# EasyEDA Pro project 辅助电源.eprj

# Schematic Schematic1
Board Name: Board1; Create Date: 2025-11-02; Page Name: P1; Project Name: 辅助电源; Schematic Name: Schematic1; Update Date: 2025-11-02; Company: 广东石油化工电子信息工程学院; Drawed: LMH; Page Size: A4; Version: V1.0
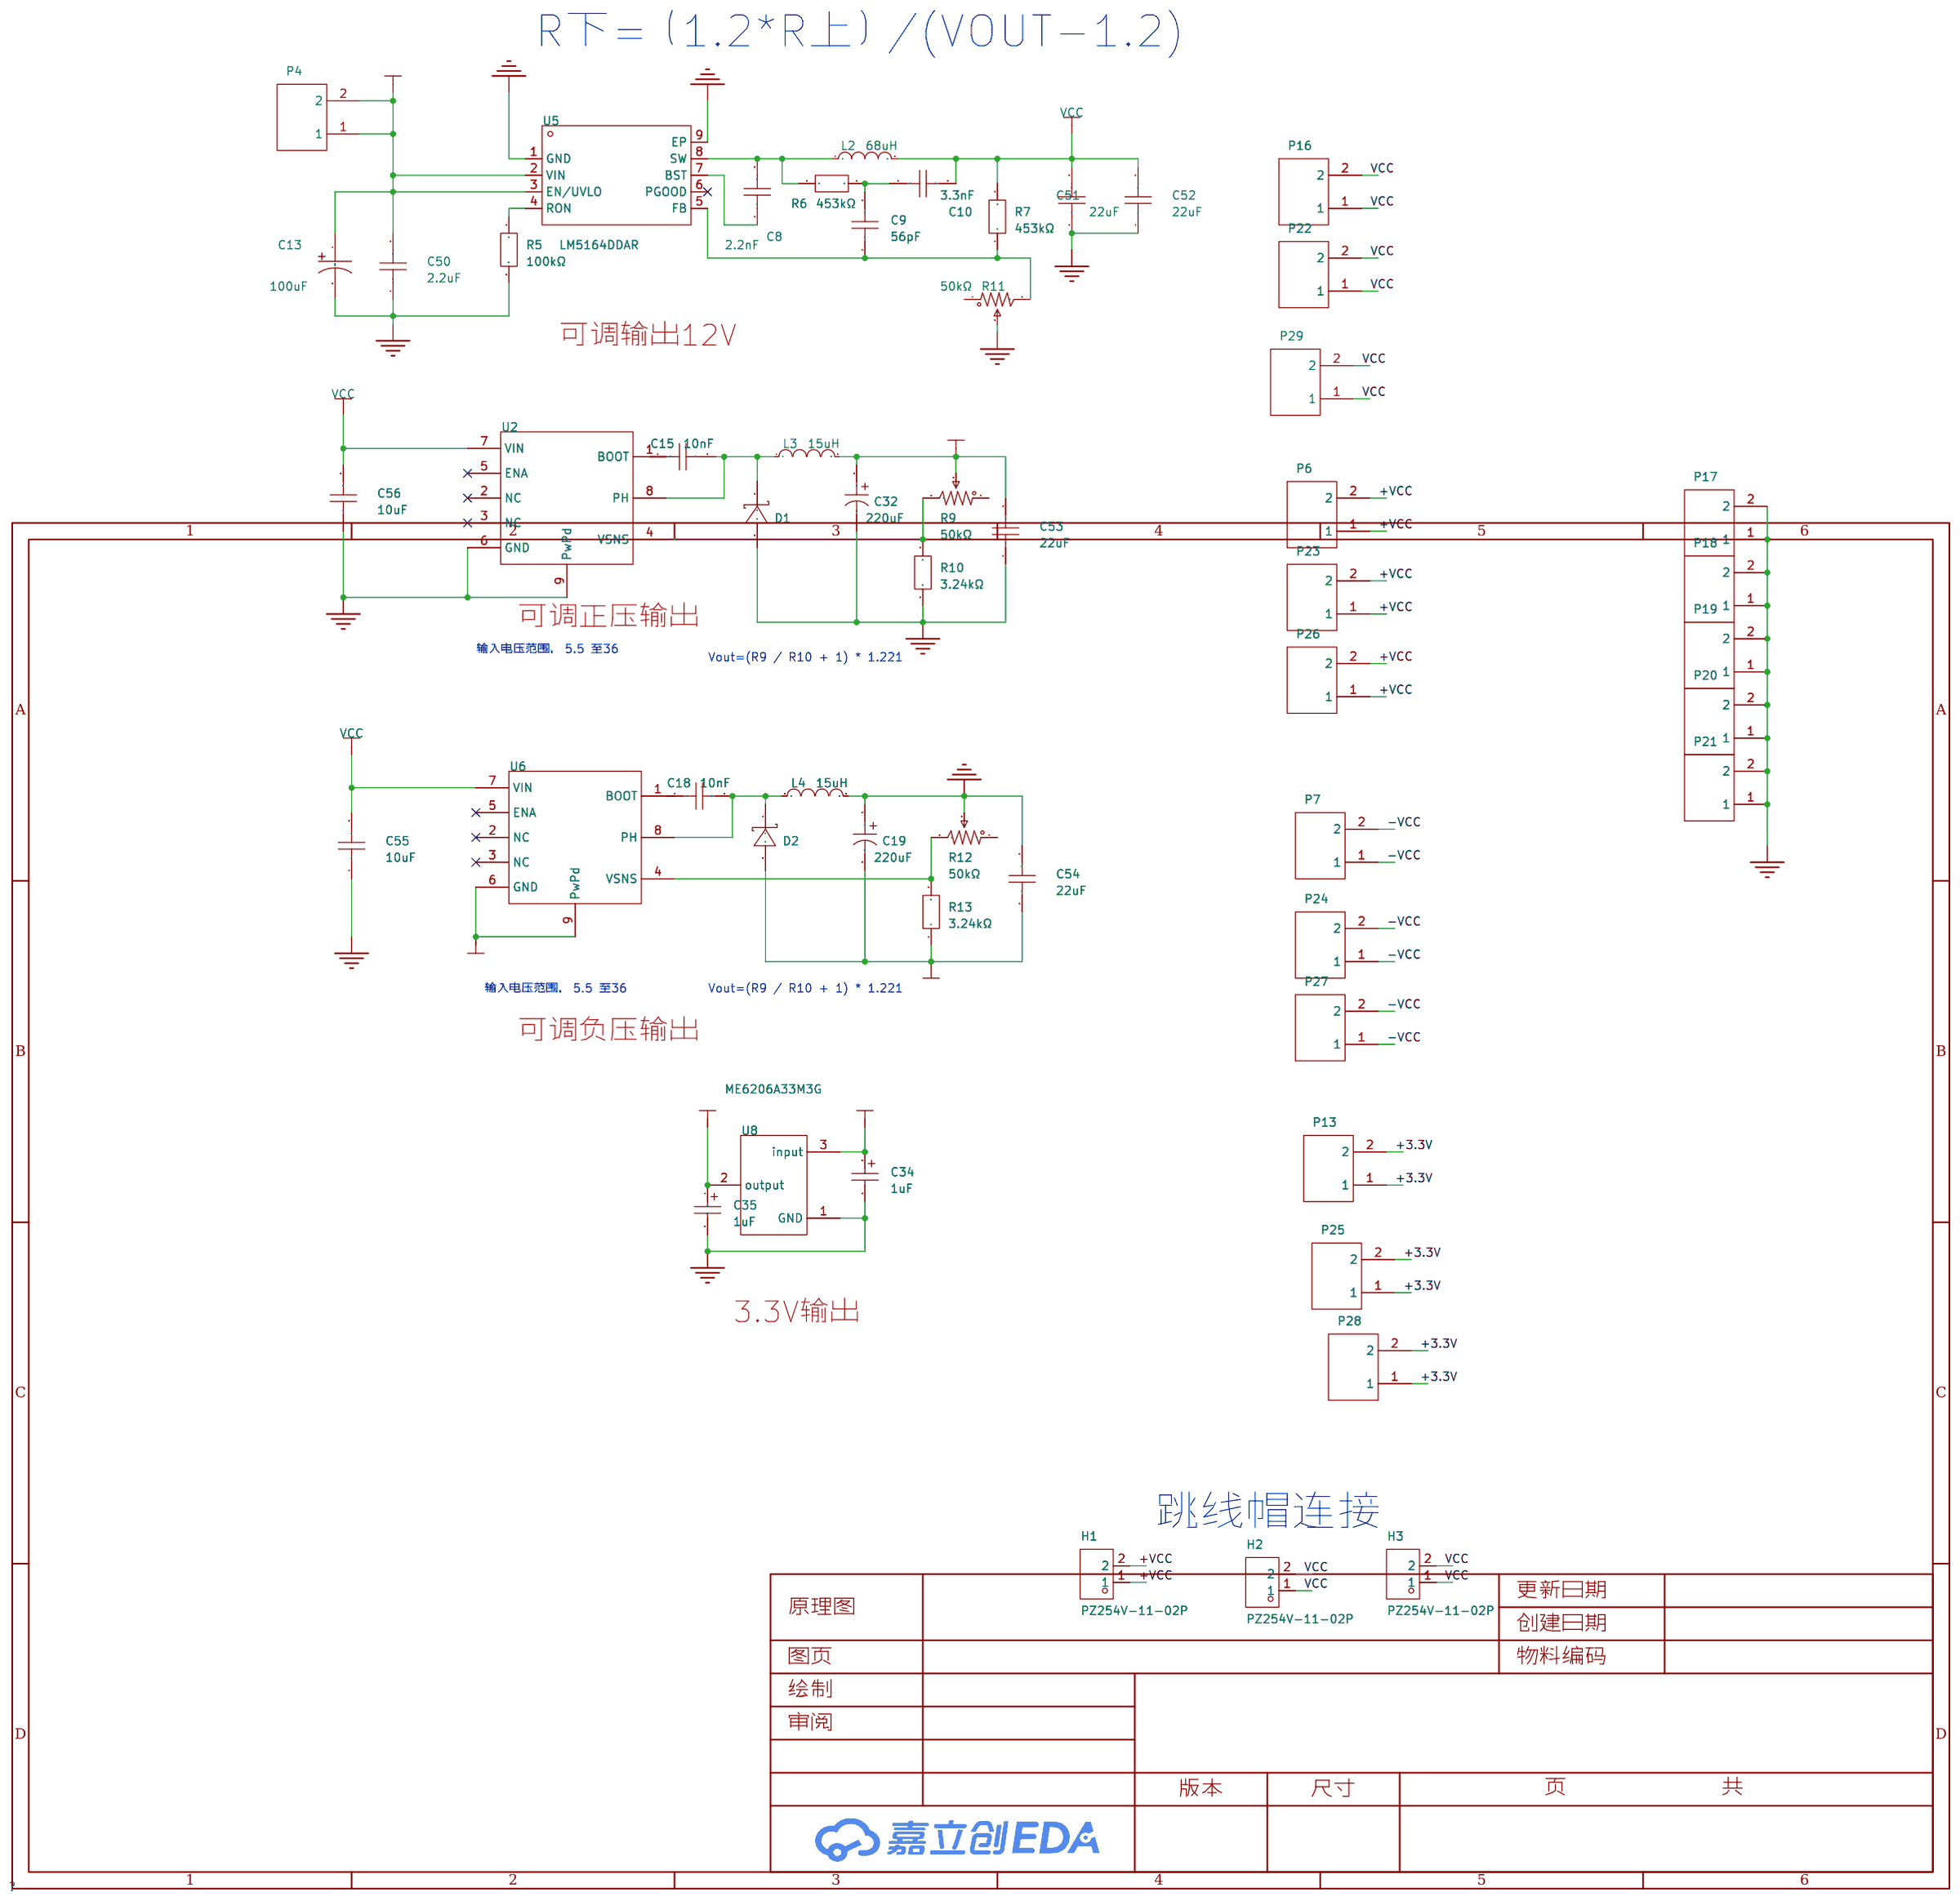
[diagram p0: schematic sheet]

## Parts
C8  2.2nF  [C0805]
C9  56pF  [C0805]
C10  3.3nF  [C0805]
C13  100uF  [CAP-TH_BD10.0-P5.00-D1.0-FD]
C15  10nF  [C0805]
C18  10nF  [C0805]
C19  220uF  [CAP-TH_BD8.0-P3.50-D0.6-FD]
C32  220uF  [CAP-TH_BD8.0-P3.50-D0.6-FD]
C34  1uF  [CASE-A_3216]
C35  1uF  [CASE-A_3216]
C50  2.2uF  [C0805]
C51  22uF  [C0805]
C52  22uF  [C0805]
C53  22uF  [C0805]
C54  22uF  [C0805]
C55  10uF  [C0805]
C56  10uF  [C0805]
D1  B340A  [SMA_L4.3-W2.6-LS5.1-RD]
D2  B340A  [SMA_L4.3-W2.6-LS5.1-RD]
H1  PZ254V-11-02P  [HDR-TH_2P-P2.54-V-M]
H2  PZ254V-11-02P  [HDR-TH_2P-P2.54-V-M]
H3  PZ254V-11-02P  [HDR-TH_2P-P2.54-V-M]
L2  68uH  [IND-SMD_L13.5-W12.8_APH1265T]
L3  15uH  [IND-SMD_L7.3-W6.8]
L4  15uH  [IND-SMD_L7.3-W6.8]
P4  WJ128V-5.0-2P  [CONN-TH_2P-P5.00_WJ128V-5.0-2P]
P6  WJ128V-5.0-2P  [CONN-TH_2P-P5.00_WJ128V-5.0-2P]
P7  WJ128V-5.0-2P  [CONN-TH_2P-P5.00_WJ128V-5.0-2P]
P13  WJ128V-5.0-2P  [CONN-TH_2P-P5.00_WJ128V-5.0-2P]
P16  WJ128V-5.0-2P  [CONN-TH_2P-P5.00_WJ128V-5.0-2P]
P17  WJ128V-5.0-2P  [CONN-TH_2P-P5.00_WJ128V-5.0-2P]
P18  WJ128V-5.0-2P  [CONN-TH_2P-P5.00_WJ128V-5.0-2P]
P19  WJ128V-5.0-2P  [CONN-TH_2P-P5.00_WJ128V-5.0-2P]
P20  WJ128V-5.0-2P  [CONN-TH_2P-P5.00_WJ128V-5.0-2P]
P21  WJ128V-5.0-2P  [CONN-TH_2P-P5.00_WJ128V-5.0-2P]
P22  WJ128V-5.0-2P  [CONN-TH_2P-P5.00_WJ128V-5.0-2P]
P23  WJ128V-5.0-2P  [CONN-TH_2P-P5.00_WJ128V-5.0-2P]
P24  WJ128V-5.0-2P  [CONN-TH_2P-P5.00_WJ128V-5.0-2P]
P25  WJ128V-5.0-2P  [CONN-TH_2P-P5.00_WJ128V-5.0-2P]
P26  WJ128V-5.0-2P  [CONN-TH_2P-P5.00_WJ128V-5.0-2P]
P27  WJ128V-5.0-2P  [CONN-TH_2P-P5.00_WJ128V-5.0-2P]
P28  WJ128V-5.0-2P  [CONN-TH_2P-P5.00_WJ128V-5.0-2P]
P29  WJ128V-5.0-2P  [CONN-TH_2P-P5.00_WJ128V-5.0-2P]
R5  100kΩ  [R0805]
R6  453kΩ  [R0805]
R7  453kΩ  [R0805]
R9  50kΩ  [RES-ADJ-TH_3P-L9.5-W4.85-P2.50-BL-BS]
R10  3.24kΩ  [R0805]
R11  50kΩ  [RES-ADJ-TH_3P-L9.5-W4.85-P2.50-BL-BS]
R12  50kΩ  [RES-ADJ-TH_3P-L9.5-W4.85-P2.50-BL-BS]
R13  3.24kΩ  [R0805]
U2  TPS5430DDAR  [ESOP-8_L4.9-W3.9-P1.27-LS6.0-TL-EP]
U5  LM5164DDAR  [SO-8_L4.9-W3.9-P1.27-LS6.0-BL-EP]
U6  TPS5430DDAR  [ESOP-8_L4.9-W3.9-P1.27-LS6.0-TL-EP]
U8  ME6206A33M3G  [SOT-23-3_L2.9-W1.6-P1.90-LS2.8-BR]

## Library data of the parts
C8 = C0805X222JAGACAUTO: 容值:2.2nF;精度:±5%;额定电压:250V;材质(温度系数):C0G;; LCSC Part Name: 2.2nF ±5% 250V; Supplier Part: C1865197; Manufacturer: KEMET(基美); Supplier Footprint: 0805; JLCPCB Part Class: 扩展库; Datasheet: https://atta.szlcsc.com/upload/public/pdf/source/20210401/D66EEDC9BCE1E33F75ADBF61867F80A3.pdf; Supplier: LCSC; Tolerance: ±5%; Voltage Rated: 250V; Temperature Coefficient: C0G
C9 = GRM21A5C2E560JW01D: 容值:56pF;精度:±5%;额定电压:250V;材质(温度系数):C0G;; LCSC Part Name: 56pF ±5% 250V; Supplier Part: C913752; Manufacturer: muRata(村田); Supplier Footprint: 0805; JLCPCB Part Class: 扩展库; Datasheet: https://atta.szlcsc.com/upload/public/pdf/source/20201110/C913752_F641B26B8F5ADC977878FA25C9EF1957.pdf; Supplier: LCSC; Tolerance: ±5%; Voltage Rated: 250V; Temperature Coefficient: C0G
C10 = GRM216R71H332KA01D: 容值:3.3nF;精度:±10%;额定电压:50V;材质(温度系数):X7R;; LCSC Part Name: 3.3nF ±10% 50V; Supplier Part: C440194; Manufacturer: muRata(村田); Supplier Footprint: 0805; Datasheet: https://atta.szlcsc.com/upload/public/pdf/source/20191022/C440211_D691AF4420B7318595498C3E4B7F2331.pdf; Supplier: LCSC; Tolerance: ±10%; Voltage Rated: 50V; Temperature Coefficient: X7R
C13 = RC100M101LO10*16TH-2A1E: 容值:100uF;精度:±20%;额定电压:100V;电容体直径:10mm;电容体长度:16mm;脚间距:5mm;纹波电流:900mA@100kHz;等效串联电阻:-;工作寿命:3000hrs@105℃;工作温度:-40℃~+105℃;; LCSC Part Name: 100uF ±20% 100V; Supplier Part: C357619; Manufacturer: BERYL(绿宝石); Supplier Footprint: 直插,D10xL16mm; JLCPCB Part Class: Extended Part; Datasheet: https://atta.szlcsc.com/upload/public/pdf/source/20190103/C357619_0BF2DB4ADDCD75013A8B5265CADB4451.pdf; Supplier: LCSC; Tolerance: ±20%; Rated Voltage: 100V; φD: 10mm; L: 16mm; Lead Spacing: 5mm; Ripple Current: 900mA@100kHz; Lifetime @ Temp: 3000hrs@105℃; Operating Temperature: -40℃~+105℃
C15 C18 = C0805C103K5HACTU: 容值:10nF;精度:±10%;额定电压:50V;材质(温度系数):X8R;; LCSC Part Name: 10nF ±10% 50V; Supplier Part: C2172728; Manufacturer: KEMET(基美); Supplier Footprint: 0805; JLCPCB Part Class: 扩展库; Datasheet: https://atta.szlcsc.com/upload/public/pdf/source/20210401/C9563F246E35C976769C1BF14FC2FE59.pdf; Supplier: LCSC; Tolerance: ±10%; Voltage Rated: 50V; Temperature Coefficient: X8R
C19 C32 = ERE1VM221F12OT: 容值:220uF;精度:±20%;额定电压:35V;纹波电流:-;等效串联电阻:-;; LCSC Part Name: 220uF ±20% 35V; Supplier Part: C106510; Manufacturer: AISHI(艾华集团); Supplier Footprint: 插件,D8xL12mm; JLCPCB Part Class: Extended Part; Datasheet: https://atta.szlcsc.com/upload/public/pdf/source/20190702/C401559_D116D2C5ED42D458EC9986A0749FDD04.pdf; Supplier: LCSC; Tolerance: ±20%; Rated Voltage: 35V; Lead Spacing: 3.5mm; φD: 8mm; L: 12mm; Lifetime @ Temp: 3000hrs@105℃
C34 C35 = TAJA105K035RNJ: 容值:1uF;精度:±10%;额定电压:35V;等效串联电阻:7.5Ω@100kHz;; LCSC Part Name: 1uF ±10% 35V; Supplier Part: C7176; Manufacturer: Kyocera AVX; Supplier Footprint: CASE-A-3216-18(mm); JLCPCB Part Class: 扩展库; Datasheet: https://atta.szlcsc.com/upload/public/pdf/source/20160107/1457707750344.pdf; Supplier: LCSC; Tolerance: ±10%; Rated Voltage: 35V; Equivalent Series Resistance(ESR): 7.5Ω@100kHz; Operating Temperature: -55℃~+125℃
C50 = CGA0805X7R225K101MT: 容值:2.2uF;精度:±10%;额定电压:100V;材质(温度系数):X7R;; LCSC Part Name: 2.2uF ±10% 100V; Supplier Part: C6119935; Manufacturer: HRE(芯声); Supplier Footprint: 0805; JLCPCB Part Class: 扩展库; Datasheet: https://atta.szlcsc.com/upload/public/pdf/source/20240429/FFBBB2C1A6FCA7F2201C7203CC19BC42.pdf; Supplier: LCSC; Tolerance: ±10%; Voltage Rated: 100V; Temperature Coefficient: X7R
C51-C54 = CGA0805X5R226M350MT: 容值:22uF;精度:±20%;额定电压:35V;材质(温度系数):X5R;; LCSC Part Name: 22uF ±20% 35V; Supplier Part: C6119901; Manufacturer: HRE(芯声); Supplier Footprint: 0805; JLCPCB Part Class: 扩展库; Datasheet: https://atta.szlcsc.com/upload/public/pdf/source/20231129/D589D0CC4D260F7AC3A77E53B455CCB3.pdf; Supplier: LCSC; Tolerance: ±20%; Voltage Rated: 35V; Temperature Coefficient: X5R
C55 C56 = GRM21BR61H106KE43L: 容值:10uF;精度:±10%;额定电压:50V;材质(温度系数):X5R;; LCSC Part Name: 10uF ±10% 50V; Supplier Part: C440198; Manufacturer: muRata(村田); Supplier Footprint: 0805; JLCPCB Part Class: 基础库; Datasheet: https://atta.szlcsc.com/upload/public/pdf/source/20230811/95AAE0C9AF55EDC31B7A4D8B733F534E.pdf; Supplier: LCSC; Tolerance: ±10%; Voltage Rated: 50V; Temperature Coefficient: X5R
D1 D2 = B340A: 直流反向耐压(Vr):40V;平均整流电流(Io):3A;正向压降(Vf):550mV@3A;; LCSC Part Name: 40V3A550mV@3A; Supplier Part: C64982; Manufacturer: MDD; Supplier Footprint: SMA(DO-214AC); JLCPCB Part Class: ExtendedPart; Datasheet: https://atta.szlcsc.com/upload/public/pdf/source/20230314/FEC98C79C2B2FE8CB6E84FEE53FCCA40.pdf; Supplier: LCSC; Reverse Voltage (Vr): 40V; Average Rectified Current (Io): 3A; Forward Voltage (Vf@If): 550mV@3A
H1-H3 = PZ254V-11-02P: 插针结构:1x2P;间距:2.54mm;行距:-;圆针/方针:方针;安装类型:直插;排数:单排;总PIN位数:2P;额定电流:-;额定电压:-;配合针长度:6mm;塑高:2.5mm;端接针长度:3mm;触头材质:黄铜;触头镀层:-;工作温度范围:-40℃~+105℃;颜色:黑色;; LCSC Part Name: 间距:2.54mm 1x2P 直插 方针; Supplier Part: C492401; Manufacturer: XFCN(兴飞); Supplier Footprint: 插件,P=2.54mm; JLCPCB Part Class: 扩展库; Datasheet: https://atta.szlcsc.com/upload/public/pdf/source/20200309/C492401_A812433581A9B211A7FFA413ADDFF0E5.pdf; Supplier: LCSC; Pin Structure: 1x2P; Pitch: 2.54mm; Circluar Pins/Square Pins: 方针; Mounting Type: 直插; Number of Rows: 单排; Number of Pins: 2P; Length of Mating Pin: 6mm; Insulation Height: 2.5mm; Length of End Connection Pin: 3mm; Contact Material: 黄铜; Operating Temperature Range: -40℃~+105℃; Color: 黑色
L2 = APH1265T680M: 电感值:68uH;精度:±20%;额定电流:4.1A;饱和电流(Isat):4.3A;类型:一体成型电感;; LCSC Part Name: 68uH ±20% 4.3A; Supplier Part: C5349642; Manufacturer: APV(爱普微); Supplier Footprint: SMD,13.5x12.8mm; JLCPCB Part Class: 扩展库; Datasheet: https://atta.szlcsc.com/upload/public/pdf/source/20240422/44C6AF90C0CE08E50D7C2708B16BB974.pdf; Supplier: LCSC; Tolerance: ±20%; Rated Current: 4.1A; Saturation Current (Isat): 4.3A; DC Resistance (DCR): 120mΩ; Type: 一体成型电感
L3 L4 = MWSA0603S-150MT: 精度:±20%;额定电流:3A;电感值:15uH;直流电阻(DCR):113mΩ;; LCSC Part Name: 15uH±20%; Supplier Part: C408452; Manufacturer: Sunlord(顺络); Supplier Footprint: SMD; JLCPCB Part Class: ExtendedPart; Datasheet: https://atta.szlcsc.com/upload/public/pdf/source/20190729/C408452_7F0A9CFF0AB8A0D8AD496F52F1F29DF7.pdf; Supplier: LCSC; Width: 7mm; Tolerance: ±20%; Length: 6.6mm; Height: 3mm; Rated Current: 3A; DC Resistance (DCR): 113mΩ
P4 P6 P7 P13 P16-P29 = WJ128V-5.0-2P: 结构:1x2P;间距:5mm;颜色:绿色;安装方式:直插;额定电流:20A;额定电压:250V;排数:1;线规 - AWG:12~22;线规 - 平方毫米:2.5;每排PIN数:2;工作温度范围:-40℃~+105℃;; LCSC Part Name: 5mm 1x2P 排数:1 每排P数:2 直插; Supplier Part: C8269; Manufacturer: KANGNEX(康奈克斯电气); Supplier Footprint: 插件,P=5mm; JLCPCB Part Class: 扩展库; Datasheet: https://atta.szlcsc.com/upload/public/pdf/source/20191225/C8269_1FF44D6D2E83DB14A7CA266A410FD9AD.pdf; Supplier: LCSC; Structure: 1x2P; Pitch: 5mm; Color: 绿色; Mounting Style: 直插; Current Rating (Max): 20A; Voltage Rating (Max): 250V; Number of Pins: 2P; Number of Rows: 1; Wire Gauge - AWG: 12~22; Wire Gauge - mm2: 2.5; Number of PINs Per Row: 2; Operating Temperature Range: -40℃~+105℃
R5 R6 = TP0805T100KP0505Z: 电阻类型:薄膜电阻;阻值:100kΩ;精度:±0.01%;温度系数:±5ppm/℃;; LCSC Part Name: 薄膜电阻 100kΩ ±0.01%; Supplier Part: C5184164; Manufacturer: EVER OHMS(天二科技); Supplier Footprint: 0805; JLCPCB Part Class: 扩展库; Datasheet: https://atta.szlcsc.com/upload/public/pdf/source/20221114/33623788AE25E42A5D888FF02D01F9C5.pdf; Supplier: LCSC; Type: 薄膜电阻; Tolerance: ±0.01%; Temperature Coefficient: ±5ppm/℃; Operating Temperature Range: -55℃~+155℃
R7 = RR1220P-4533-D-M: 电阻类型:薄膜电阻;阻值:453kΩ;精度:±0.5%;功率:100mW;最大工作电压:100V;温度系数:±25ppm/℃;; LCSC Part Name: 薄膜电阻 453kΩ ±0.5% 100mW; Supplier Part: C2101050; Manufacturer: SUSUMU; Supplier Footprint: 0805; JLCPCB Part Class: 扩展库; Datasheet: https://atta.szlcsc.com/upload/public/pdf/source/20181213/C351141_92BFA8729184E85408E82C4FD750EBD0.pdf; Supplier: LCSC; Type: 薄膜电阻; Tolerance: ±0.5%; Power(Watts): 100mW; Overload Voltage (Max): 100V; Temperature Coefficient: ±25ppm/℃; Operating Temperature Range: -55℃~+125℃
R9 R11 R12 = 3296W-1-503: 阻值:50kΩ;精度:±10%;; LCSC Part Name: 50kΩ ±10%; Supplier Part: C118911; Manufacturer: BOCHEN(博晨); Supplier Footprint: 插件; JLCPCB Part Class: Extended Part; Datasheet: https://atta.szlcsc.com/upload/public/pdf/source/20171114/C118911_15106326557211117401.pdf; Supplier: LCSC; Tolerance: ±10%
R10 R13 = RCA053K24FLF: 阻值:3.24kΩ;精度:±1%;功率:125mW;; LCSC Part Name: 3.24kΩ ±1% 125mW; Supplier Part: C22369998; Manufacturer: HKR(香港电阻); Supplier Footprint: 0805; Datasheet: https://atta.szlcsc.com/upload/public/pdf/source/20240327/626E23E3B2A799D2C85303DE2C37BB2A.pdf; Supplier: LCSC; Tolerance: ±1%; Power(Watts): 125mW
U2 U6 = TPS5430DDAR: 功能类型:降压型;同步整流:-;输出通道数:-;拓扑结构:-;输入电压:-;输出电流(最大值):-;开关频率:-;; LCSC Part Name: 降压型; Supplier Part: C9864; Manufacturer: TI(德州仪器); Supplier Footprint: SO-8; JLCPCB Part Class: BasicPart; Datasheet: https://atta.szlcsc.com/upload/public/pdf/source/20161207/1481104217724.pdf; Supplier: LCSC; Function: 降压型
U5 = LM5164DDAR: 功能类型:降压型;输出类型:可调;输入电压:6V~100V;输出电压:1.2V~100V;输出电流(最大值):1A;; LCSC Part Name: 降压型 输入6V~100V 输出1.2V~100V 1A; Supplier Part: C477928; Manufacturer: TI(德州仪器); Supplier Footprint: SO-8-EP; JLCPCB Part Class: Extended Part; Datasheet: https://atta.szlcsc.com/upload/public/pdf/source/20200102/C477928_A6130A40DCA2C193067E68A47DE8CF0C.pdf; Supplier: LCSC; Function: 降压型; Synchronous Rectification: 是; Output Type: 可调; Number of Outputs: 1; Topology: 降压式; Input Voltage: 6V~100V; Output Voltage: 1.2V~100V; Output Current (Max): 1A; Switching Frequency: 1MHz; Operating Temperature: -40℃~+150℃@(TJ)
U8 = ME6206A33M3G: 输出类型:固定;输出极性:正;最大输入电压:6V;输出电压:3.3V;输出电流:300mA;电源纹波抑制比(PSRR):50dB@(1kHz);; Supplier Part: C35259; Manufacturer: MICRONE(南京微盟); Supplier Footprint: SOT-23-3L; JLCPCB Part Class: Extended Part; Datasheet: https://atta.szlcsc.com/upload/public/pdf/source/20171014/C35259_15079757490131038524.pdf; Supplier: LCSC; Output Type: 固定; Output Polarity: 正; Number of Outputs: 1; Maximum Input Voltage: 6V; Output Voltage: 3.3V; Dropout Voltage: 380mV@(200mA); Output Current: 300mA; Power Supply Rejection Ratio (PSRR): 50dB@(1kHz)

## Nets
+3.3V: C35.1 P13.1 P13.2 P25.1 P25.2 P28.1 P28.2 U8.2(output)
+VCC: C32.1 C34.1 C53.2 H1.1 H1.2 L3.2 P6.1 P6.2 P23.1 P23.2 P26.1 P26.2 R9.2 U8.3(input)
-VCC: C19.2 C54.1 D2.2(A) P7.1 P7.2 P24.1 P24.2 P27.1 P27.2 R13.1 U6.6(GND) U6.9(PwPd)
GND: C13.2 C19.1 C32.2 C34.2 C35.2 C50.1 C51.1 C52.1 C53.1 C54.2 C55.1 C56.1 D1.2(A) L4.2 P17.1 P17.2 P18.1 P18.2 P19.1 P19.2 P20.1 P20.2 P21.1 P21.2 R5.2 R10.1 R11.2 R12.2 U2.6(GND) U2.9(PwPd) U5.1(GND) U5.9(EP) U8.1(GND)
VCC: C10.2 C51.2 C52.2 C55.2 C56.2 H2.1 H2.2 H3.1 H3.2 L2.2 P16.1 P16.2 P22.1 P22.2 P29.1 P29.2 R7.2 U2.7(VIN) U6.7(VIN)
VIN: C13.1 C50.2 P4.1 P4.2 U5.2(VIN) U5.3(EN/UVLO)
$1N709: R5.1 U5.4(RON)
$1N713: C8.2 L2.1 R6.2 U5.8(SW)
$1N714: C8.1 U5.7(BST)
$1N716: C9.2 C10.1 R6.1
$1N717: C9.1 R7.1 R11.3 U5.5(FB)
$1N1636: C15.1 U2.1(BOOT)
$1N1637: C15.2 D1.1(K) L3.1 U2.8(PH)
$1N1642: C18.1 U6.1(BOOT)
$1N1643: C18.2 D2.1(K) L4.1 U6.8(PH)
$1N1649: R12.3 R13.2 U6.4(VSNS)
$1N1651: R9.3 R10.2 U2.4(VSNS)

Not connected (* = marked no-connect by the designer): R9 1; R11 1; R12 1; U2 2(NC)* 3(NC)* 5(ENA)*; U5 6(PGOOD)*; U6 2(NC)* 3(NC)* 5(ENA)*

## Notes on the sheet
- R下=（1.2*R上）/(VOUT-1.2)
- 可调输出12V
- 可调正压输出
- 输入电压范围， 5.5 至36
- Vout=(R9 / R10 + 1) * 1.221
- 输入电压范围， 5.5 至36
- Vout=(R9 / R10 + 1) * 1.221
- 可调负压输出
- 3.3V输出
- 跳线帽连接

# Board PCB2
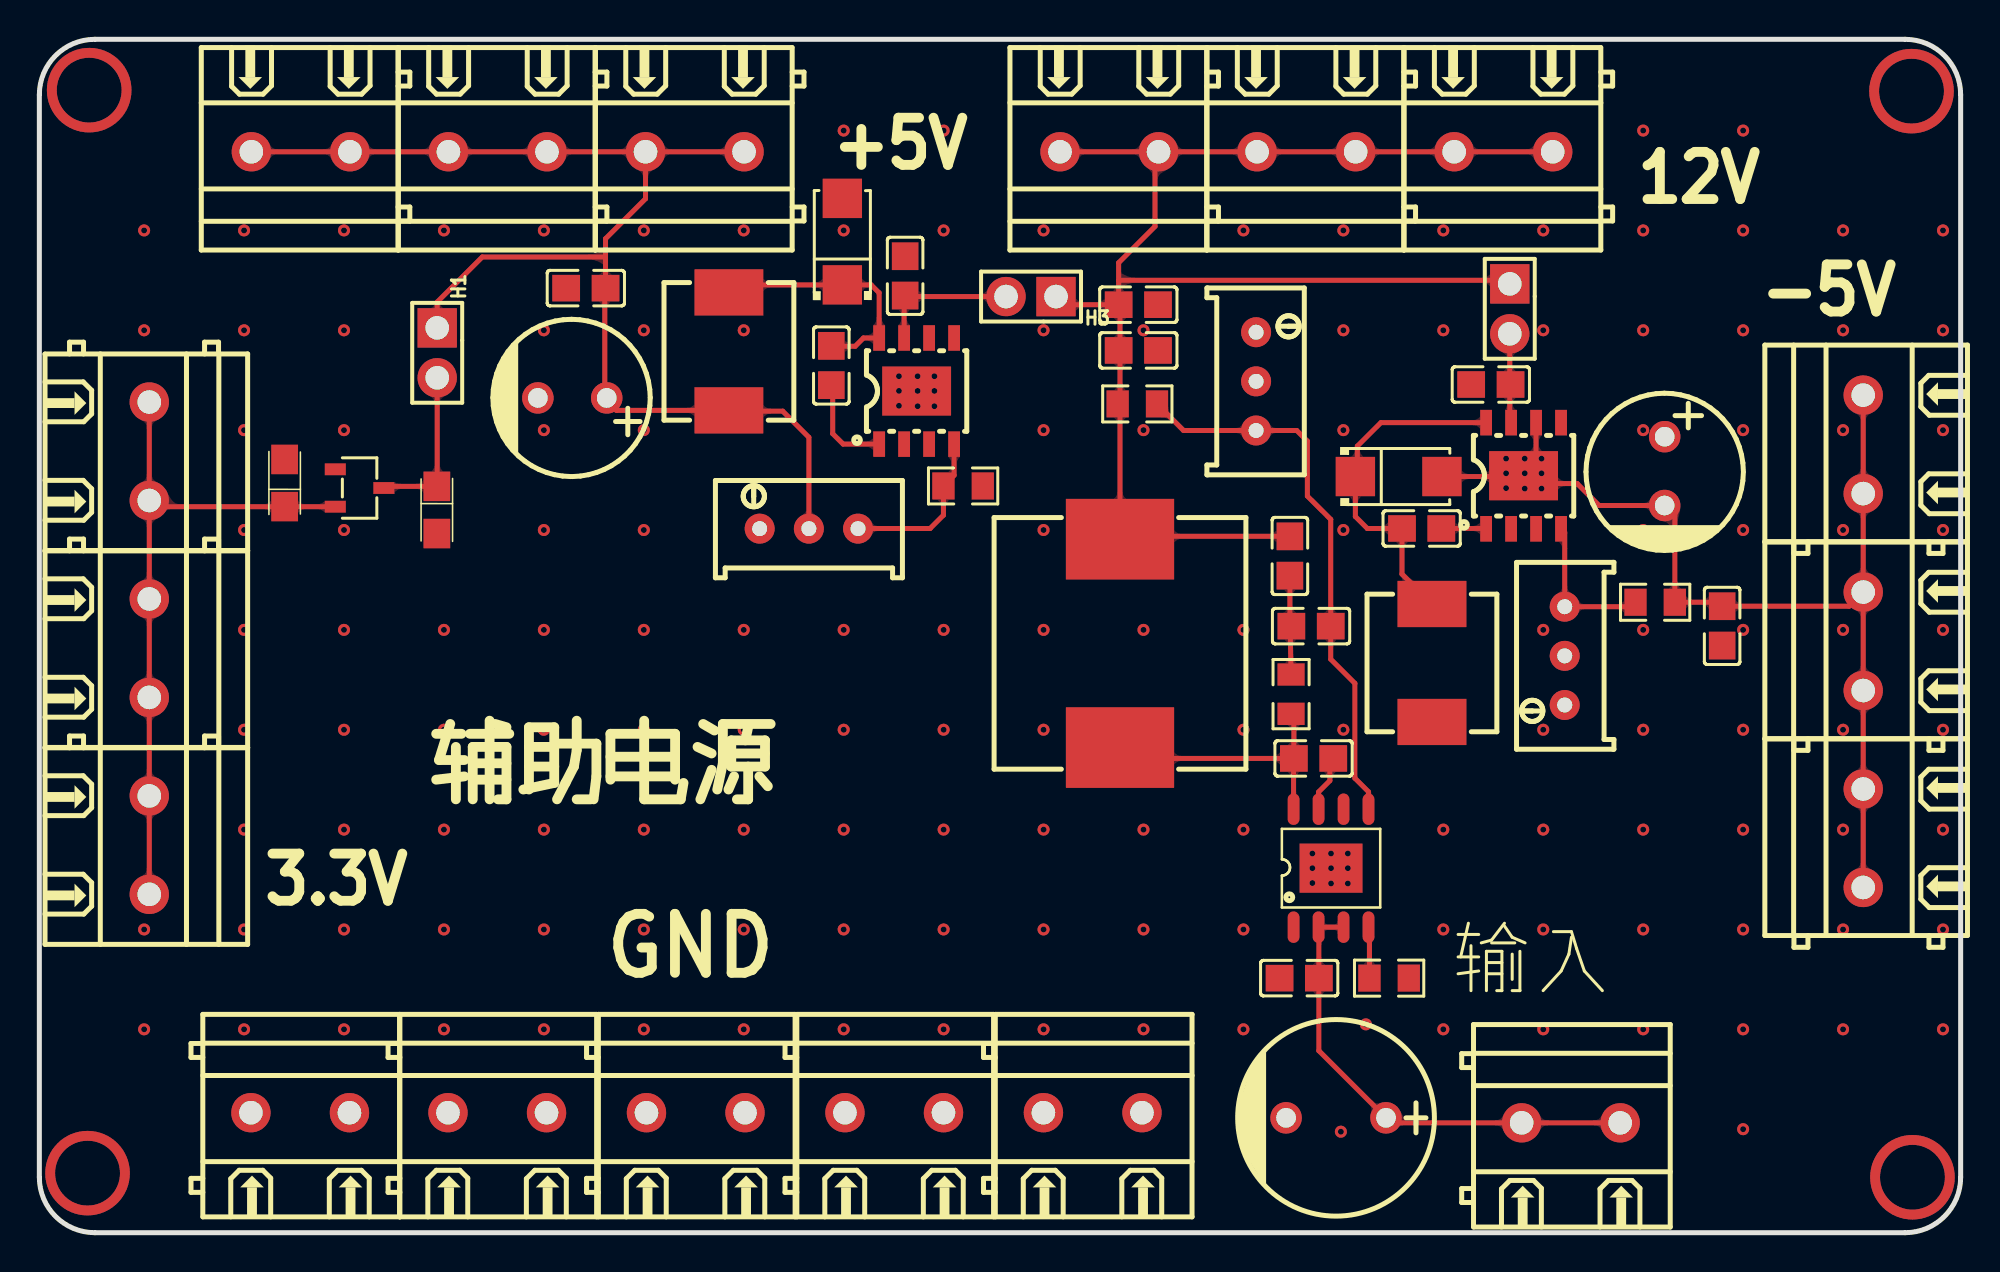
[diagram p1: board, top side]
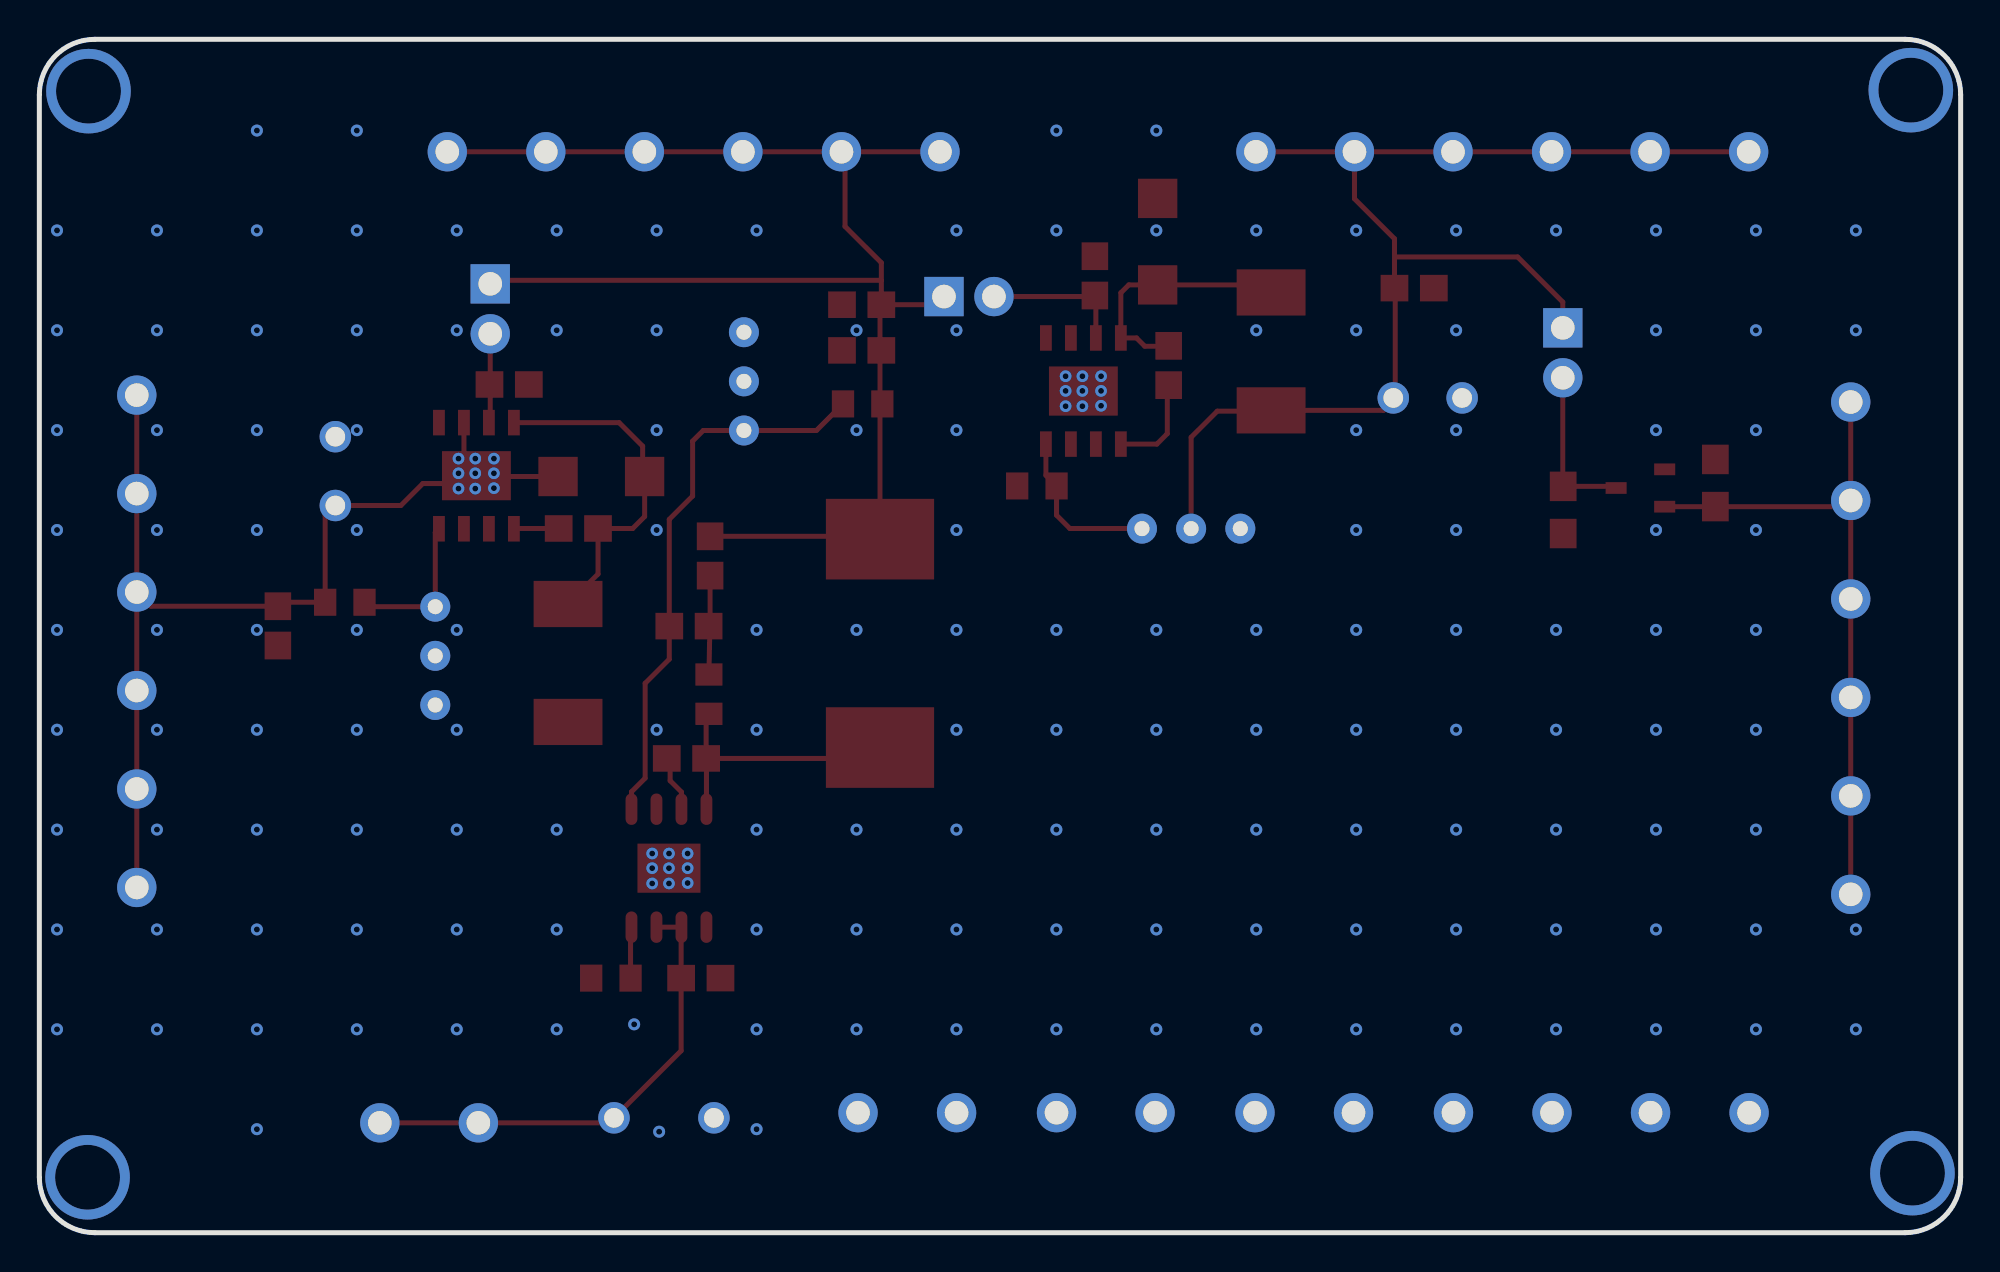
[diagram p2: board, bottom side, seen from below]

Outline 97.66 x 60.71 mm; copper layers: Top Layer, Bottom Layer. Coordinates in mm from the lower left corner of the outline.
Outline path: 0,57.89 arc(0.83,59.88) 2.82,60.71 94.84,60.71 arc(96.84,59.88) 97.66,57.89 97.66,2.82 arc(96.84,0.83) 94.84,0 2.82,0 arc(0.83,0.83) 0,2.82 0,57.89
Stack: Top Layer 0.035mm / Dielectric1 1.51mm FR4 er 4.5 / Bottom Layer 0.035mm

## Design rules (mm)
template: 自定义配置
spacing copperThickness1oz (default): track to track 0.102, other pairs 0.152 to 0.3
spacing copperThickness2oz: track to track 0.203, other pairs 0.152 to 0.3
track width copperThickness1oz (default): min 0.127, default 0.254, max 2.54
track width copperThickness2oz: min 0.203, default 0.254, max 2.54
differential pair differentialPair (default): width min 0.127, default 0.254, max 2.54; gap min 0.152, default 0.152
via viaSize (default): diameter min 0.5, default 0.61, max 10; hole min 0.3, default 0.305, max 6.3

## Placement (name value [footprint] x y rotation side)
3.3V  WJ128V-5.0-2P  [CONN-TH_2P-P5.00_WJ128V-5.0-2P]  5.59 29.73 270 top
12V  WJ128V-5.0-2P  [CONN-TH_2P-P5.00_WJ128V-5.0-2P]  74.42 54.99 180 top
+5V  WJ128V-5.0-2P  [CONN-TH_2P-P5.00_WJ128V-5.0-2P]  23.3 54.99 180 top
-5V  WJ128V-5.0-2P  [CONN-TH_2P-P5.00_WJ128V-5.0-2P]  92.71 40.1 90 top
C8  2.2nF  [C0805]  64.77 24.12 180 top
C9  56pF  [C0805]  64.64 30.86 180 top
C10  3.3nF  [C0805]  63.57 34.42 90 top
C13  100uF  [CAP-TH_BD10.0-P5.00-D1.0-FD]  65.91 5.84 180 top
C15  10nF  [C0805]  40.26 44.11 90 top
C18  10nF  [C0805]  70.26 35.82 180 top
C19  220uF  [CAP-TH_BD8.0-P3.50-D0.6-FD]  82.62 38.74 270 top
C32  220uF  [CAP-TH_BD8.0-P3.50-D0.6-FD]  27.09 42.46 180 top
C34  1uF  [CASE-A_3216]  20.2 36.77 270 top
C35  1uF  [CASE-A_3216]  12.47 38.14 90 top
C50  2.2uF  [C0805]  64.04 12.95 0 top
C51  22uF  [C0805]  55.86 44.88 180 top
C52  22uF  [C0805]  55.86 47.21 180 top
C53  22uF  [C0805]  27.78 48.05 0 top
C54  22uF  [C0805]  85.54 30.87 270 top
C55  10uF  [C0805]  73.78 43.15 0 top
C56  10uF  [C0805]  44.01 48.67 270 top
D1  B340A  [SMA_L4.3-W2.6-LS5.1-RD]  40.82 50.41 90 top
D2  B340A  [SMA_L4.3-W2.6-LS5.1-RD]  69.1 38.47 0 top
GND  -  [CONN-TH_2P-P5.00_WJ128V-5.0-2P]  23.28 6.1 0 top
GND#2  -  [CONN-TH_2P-P5.00_WJ128V-5.0-2P]  13.26 6.1 0 top
H1  PZ254V-11-02P  [HDR-TH_2P-P2.54-V-M]  20.22 44.76 270 top
H2  PZ254V-11-02P  [HDR-TH_2P-P2.54-V-M]  74.74 47 270 top
H3  PZ254V-11-02P  [HDR-TH_2P-P2.54-V-M]  50.41 47.62 180 top
L2  68uH  [IND-SMD_L13.5-W12.8_APH1265T]  54.93 29.98 90 top
L3  15uH  [IND-SMD_L7.3-W6.8]  35.05 44.83 270 top
L4  15uH  [IND-SMD_L7.3-W6.8]  70.79 28.98 270 top
P6  WJ128V-5.0-2P  [CONN-TH_2P-P5.00_WJ128V-5.0-2P]  13.28 54.99 180 top
P18  WJ128V-5.0-2P  [CONN-TH_2P-P5.00_WJ128V-5.0-2P]  33.37 6.1 0 top
P19  WJ128V-5.0-2P  [CONN-TH_2P-P5.00_WJ128V-5.0-2P]  43.45 6.1 0 top
P20  WJ128V-5.0-2P  [CONN-TH_2P-P5.00_WJ128V-5.0-2P]  53.54 6.1 0 top
P22  WJ128V-5.0-2P  [CONN-TH_2P-P5.00_WJ128V-5.0-2P]  64.4 54.99 180 top
P24  WJ128V-5.0-2P  [CONN-TH_2P-P5.00_WJ128V-5.0-2P]  92.71 30.08 90 top
P25  WJ128V-5.0-2P  [CONN-TH_2P-P5.00_WJ128V-5.0-2P]  5.59 39.75 270 top
P26  WJ128V-5.0-2P  [CONN-TH_2P-P5.00_WJ128V-5.0-2P]  33.32 54.99 180 top
P27  WJ128V-5.0-2P  [CONN-TH_2P-P5.00_WJ128V-5.0-2P]  92.71 20.07 90 top
P28  WJ128V-5.0-2P  [CONN-TH_2P-P5.00_WJ128V-5.0-2P]  5.59 19.72 270 top
P29  WJ128V-5.0-2P  [CONN-TH_2P-P5.00_WJ128V-5.0-2P]  54.39 54.99 180 top
R5  100kΩ  [R0805]  68.61 12.95 0 top
R6  453kΩ  [R0805]  63.63 27.4 270 top
R7  453kΩ  [R0805]  55.81 42.16 180 top
R9  50kΩ  [RES-ADJ-TH_3P-L9.5-W4.85-P2.50-BL-BS]  39.12 35.81 90 top
R10  3.24kΩ  [R0805]  46.96 37.99 180 top
R11  50kΩ  [RES-ADJ-TH_3P-L9.5-W4.85-P2.50-BL-BS]  61.85 43.31 0 top
R12  50kΩ  [RES-ADJ-TH_3P-L9.5-W4.85-P2.50-BL-BS]  77.54 29.34 180 top
R13  3.24kΩ  [R0805]  82.13 32.07 180 top
U2  TPS5430DDAR  [ESOP-8_L4.9-W3.9-P1.27-LS6.0-TL-EP]  44.59 42.81 90 top
U5  LM5164DDAR  [SO-8_L4.9-W3.9-P1.27-LS6.0-BL-EP]  65.66 18.54 0 top
U6  TPS5430DDAR  [ESOP-8_L4.9-W3.9-P1.27-LS6.0-TL-EP]  75.45 38.51 90 top
U8  ME6206A33M3G  [SOT-23-3_L2.9-W1.6-P1.90-LS2.8-BR]  16.28 37.88 180 top
输入  WJ128V-5.0-2P  [CONN-TH_2P-P5.00_WJ128V-5.0-2P]  77.85 5.59 0 top

## Footprints (pads in the part's own frame, mm; a bottom-side part is the same pattern mirrored in y, then rotated)
C0805
  rect 1.41x1.35 smd: 1(-1,0) 2(1,0)
CAP-TH_BD8.0-P3.50-D0.6-FD
  round 1.6 hole 1: 1(-1.75,0) 2(1.75,0)
CAP-TH_BD10.0-P5.00-D1.0-FD
  round 1.6 hole 1: 1(-2.54,0) 2(2.54,0)
CASE-A_3216
  rect 1.5x1.359 smd: 1(-1.2,0) 2(1.2,0)
CONN-TH_2P-P5.00_WJ128V-5.0-2P
  round 2 hole 1.2: 1(-2.505,0) 2(2.505,0)
ESOP-8_L4.9-W3.9-P1.27-LS6.0-TL-EP
  rect 1.3x0.6 smd: 1(-2.7,1.905) 2(-2.7,0.635) 3(-2.7,-0.635) 4(-2.7,-1.905) 5(2.7,-1.905) 6(2.7,-0.635) 7(2.7,0.635) 8(2.7,1.905)
  rect 2.5x3.5 smd: 9(0,0)
HDR-TH_2P-P2.54-V-M
  rect 2x2 hole 1.2: 1(-1.27,0)
  round 2 hole 1.2: 2(1.27,0)
IND-SMD_L7.3-W6.8
  rect 2.35x3.5 smd: 1(-3,0) 2(3,0)
IND-SMD_L13.5-W12.8_APH1265T
  rect 4.1x5.5 smd: 1(-5.3,0) 2(5.3,0)
R0805
  rect 1.133x1.377 smd: 1(-1,0) 2(1,0)
RES-ADJ-TH_3P-L9.5-W4.85-P2.50-BL-BS
  round 1.524 hole 0.762: 1(0,2.5) 2(0,0) 3(0,-2.5)
SMA_L4.3-W2.6-LS5.1-RD
  rect 2x2 smd: 1(-2.2,0) 2(2.2,0)
SO-8_L4.9-W3.9-P1.27-LS6.0-BL-EP
  oval 0.6x1.6 smd: 1(-1.905,-3) 2(-0.635,-3) 3(0.635,-3) 4(1.905,-3) 5(1.905,3) 6(0.635,3) 7(-0.635,3) 8(-1.905,3)
  rect 3.2x2.5 smd: 9(0,0)
SOT-23-3_L2.9-W1.6-P1.90-LS2.8-BR
  rect 1.07x0.6 smd: 1(1.235,-0.95) 2(1.235,0.95) 3(-1.235,0)

## Nets
+3.3V: 3.3V.1 3.3V.2 C35.1 P25.1 P25.2 P28.1 P28.2 U8.2
+VCC: +5V.1 +5V.2 C32.1 C34.1 C53.2 H1.1 H1.2 L3.2 P6.1 P6.2 P26.1 P26.2 R9.2 U8.3
-VCC: -5V.1 -5V.2 C19.2 C54.1 D2.2 P24.1 P24.2 P27.1 P27.2 R13.1 U6.6 U6.9
GND: C13.2 C19.1 C32.2 C34.2 C35.2 C50.1 C51.1 C52.1 C53.1 C54.2 C55.1 C56.1 D1.2 GND.1 GND.2 GND#2.1 GND#2.2 L4.2 P18.1 P18.2 P19.1 P19.2 P20.1 P20.2 R5.2 R10.1 R11.2 R12.2 U2.6 U2.9 U5.1 U5.9 U8.1
VCC: 12V.1 12V.2 C10.2 C51.2 C52.2 C55.2 C56.2 H2.1 H2.2 H3.1 H3.2 L2.2 P22.1 P22.2 P29.1 P29.2 R7.2 U2.7 U6.7
VIN: C13.1 C50.2 U5.2 U5.3 输入.1 输入.2
$1N709: R5.1 U5.4
$1N713: C8.2 L2.1 R6.2 U5.8
$1N714: C8.1 U5.7
$1N716: C9.2 C10.1 R6.1
$1N717: C9.1 R7.1 R11.3 U5.5
$1N1636: C15.1 U2.1
$1N1637: C15.2 D1.1 L3.1 U2.8
$1N1642: C18.1 U6.1
$1N1643: C18.2 D2.1 L4.1 U6.8
$1N1649: R12.3 R13.2 U6.4
$1N1651: R9.3 R10.2 U2.4

Pads without a net: R9 1; R11 1; R12 1; U2 2 3 5; U5 6; U6 2 3 5

## Via types
v1: diameter 4.3, hole 3.3, Top Layer to Bottom Layer, 4 vias
v2: diameter 0.61, hole 0.305, Top Layer to Bottom Layer, 147 vias
v3: diameter 0.6, hole 0.3, Top Layer to Bottom Layer, 27 vias

## Routing (per net, layer and track width the routed paths; a pad name or vN(x,y) marks a point on that pad's centre or on a via; arc(x,y) is an arc through that point)
+3.3V: length 34.6
  Top Layer w0.254: P25.2 3.3V.1 3.3V.2 P28.1 P28.2 ; P25.2 5.9,36.93 U8.2 ; P25.2 P25.1
+VCC: length 73.4
  Top Layer w0.254: 28.78,49.64 28.78,50.56 30.81,52.6 P26.2 ; 28.78,49.64 22.52,49.64 20.22,47.34 H1.1 ; 28.78,49.64 C53.2 28.74,48.01 28.74,42.42 29.33,41.83 L3.2 35.09,41.79 37.79,41.79 39.12,40.46 R9.2 ; P6.2 P6.1 +5V.2 P26.2 ; P26.2 35.82,54.99 ; H1.2 20.22,37.98 C34.1 17.6,37.97 17.51,37.88
-VCC: length 55.1
  Top Layer w0.254: P24.2 91.99,31.87 C54.1 85.34,32.07 R13.1 83.13,36.47 C19.2 79.29,36.99 78.17,38.11 75.85,38.11 U6.9 ; P24.2 -5V.2 ; P24.2 P24.1 P27.2 92.71,17.56 ; U6.9 76.08,39.14 U6.6 ; U6.9 75.4,38.47 71.3,38.47
  vias: v3(74.56,39.38) v3(74.56,38.63) v3(74.56,37.87) v3(75.5,39.38) v3(75.51,38.63) v3(75.51,37.85) v3(76.36,39.38) v3(76.36,38.63) v3(76.36,37.85)
GND:
  vias: v2(5.33,50.98) v2(5.33,45.9) v2(5.33,15.42) v2(5.33,10.34) v2(10.41,50.98) v2(10.41,45.9) v2(10.41,40.82) v2(10.41,35.74) v2(10.41,30.66) v2(10.41,25.58) v2(10.41,20.5) v2(10.41,15.42) v2(10.41,10.34) v2(15.49,50.98) v2(15.49,45.9) v2(15.49,40.82) v2(15.49,35.74) v2(15.49,30.66) v2(15.49,25.58) v2(15.49,20.5) v2(15.49,15.42) v2(15.49,10.34) v2(20.57,50.98) v2(20.57,30.66) v2(20.57,25.58) v2(20.57,20.5) v2(20.57,15.42) v2(20.57,10.34) v2(25.65,50.98) v2(25.65,45.9) v2(25.65,40.82) v2(25.65,35.74) v2(25.65,30.66) v2(25.65,25.58) v2(25.65,20.5) v2(25.65,15.42) v2(25.65,10.34) v2(30.73,50.98) v2(30.73,45.9) v2(30.73,40.82) v2(30.73,35.74) v2(30.73,30.66) v2(30.73,25.58) v2(30.73,20.5) v2(30.73,15.42) v2(30.73,10.34) v2(35.81,50.98) v2(35.81,45.9) v2(35.81,30.66) v2(35.81,25.58) v2(35.81,20.5) v2(35.81,15.42) v2(35.81,10.34) v2(40.89,56.06) v2(40.89,50.98) v2(40.89,30.66) v2(40.89,25.58) v2(40.89,20.5) v2(40.89,15.42) v2(40.89,10.34) v2(45.97,56.06) v2(45.97,50.98) v2(45.97,30.66) v2(45.97,25.58) v2(45.97,20.5) v2(45.97,15.42) v2(45.97,10.34) v2(51.05,50.98) v2(51.05,45.9) v2(51.05,40.82) v2(51.05,35.74) v2(51.05,30.66) v2(51.05,25.58) v2(51.05,20.5) v2(51.05,15.42) v2(51.05,10.34) v2(56.13,45.9) v2(56.13,40.82) v2(56.13,30.66) v2(56.13,20.5) v2(56.13,15.42) v2(56.13,10.34) v2(61.21,50.98) v2(61.21,30.66) v2(61.21,25.58) v2(61.21,20.5) v2(61.21,15.42) v2(61.21,10.34) v2(61.21,5.26) v2(66.16,5.14) v2(66.29,50.98) v2(66.29,45.9) v2(66.29,40.82) v2(66.29,35.74) v2(66.29,25.58) v2(67.43,10.6) v2(71.37,50.98) v2(71.37,45.9) v2(71.37,20.5) v2(71.37,15.42) v2(71.37,10.34) v2(76.45,50.98) v2(76.45,45.9) v2(76.45,30.66) v2(76.45,25.58) v2(76.45,20.5) v2(76.45,15.42) v2(76.45,10.34) v2(81.53,56.06) v2(81.53,50.98) v2(81.53,45.9) v2(81.53,40.82) v2(81.53,35.74) v2(81.53,30.66) v2(81.53,25.58) v2(81.53,20.5) v2(81.53,15.42) v2(81.53,10.34) v2(86.61,56.06) v2(86.61,50.98) v2(86.61,45.9) v2(86.61,40.82) v2(86.61,35.74) v2(86.61,30.66) v2(86.61,25.58) v2(86.61,20.5) v2(86.61,15.42) v2(86.61,10.34) v2(86.61,5.26) v2(91.69,50.98) v2(91.69,45.9) v2(91.69,40.82) v2(91.69,35.74) v2(91.69,30.66) v2(91.69,25.58) v2(91.69,20.5) v2(91.69,15.42) v2(91.69,10.34) v2(96.77,50.98) v2(96.77,45.9) v2(96.77,40.82) v2(96.77,35.74) v2(96.77,30.66) v2(96.77,25.58) v2(96.77,20.5) v2(96.77,15.42) v2(96.77,10.34) v3(43.7,43.57) v3(43.7,42.82) v3(43.7,42.07) v3(44.64,43.57) v3(44.64,42.82) v3(44.64,42.04) v3(45.5,43.57) v3(45.5,42.82) v3(45.5,42.04) v3(64.71,19.29) v3(64.71,18.54) v3(64.71,17.79) v3(65.66,19.29) v3(65.66,18.54) v3(65.66,17.76) v3(66.51,19.29) v3(66.51,18.54) v3(66.51,17.76)
VCC: length 89.5
  Top Layer w0.254: P29.1 P22.2 P22.1 12V.2 12V.1 ; P29.1 P29.2 ; P29.1 56.71,54.81 56.71,51.19 54.86,49.34 54.86,48.45 ; C52.2 54.86,48.45 ; C52.2 52.09,47.21 H3.1 ; C52.2 54.93,47.14 L2.2 55.08,35.42 C10.2 ; 54.86,48.45 74.56,48.45 H2.1 ; H3.2 44.06,47.62 C56.2 43.96,47.62 U2.7 ; H2.2 74.74,41.27 U6.7
VIN: length 24.4
  Top Layer w0.254: U5.3 U5.2 65.04,15.53 C50.2 65.04,9.26 C13.1 68.71,5.59 输入.1 输入.2
(no net):
  vias: v1(2.45,3.03) v1(2.53,58.12) v1(95.17,58.07) v1(95.21,2.82)
$1N709: length 2.6
  Top Layer w0.254: U5.4 67.61,15.5 R5.1
$1N713: length 14
  Top Layer w0.254: C8.2 63.75,24.11 U5.8 ; C8.2 63.77,26.25 R6.2 ; C8.2 55.48,24.12 L2.1
$1N714: length 2.9
  Top Layer w0.254: C8.1 65.6,23.95 65.6,22.99 65.02,22.42 U5.7
$1N716: length 5.5
  Top Layer w0.254: 63.57,31.31 63.59,31.29 C9.2 ; 63.57,31.31 63.57,31.31 C10.1 ; 63.57,31.31 R6.1
$1N717: length 28.4
  Top Layer w0.254: U5.5 67.56,22.43 66.87,23.12 66.87,27.95 65.64,29.17 C9.1 65.64,36.28 64.46,37.47 64.46,40.27 63.91,40.81 R11.3 58.16,40.81 R7.1
$1N1636: length 5.1
  Top Layer w0.254: U2.1 40.86,40.11 40.33,40.65 40.33,42.94 40.26,43.01 C15.1
$1N1637: length 12.9
  Top Layer w0.254: C15.2 40.28,45.09 41.47,45.09 41.89,45.51 U2.8 42.69,47.81 42.28,48.21 D1.1 35.43,48.21 L3.1
$1N1642: length 2.3
  Top Layer w0.254: U6.1 73.52,35.82 C18.1
$1N1643: length 17.8
  Top Layer w0.254: L4.1 69.26,33.51 C18.2 69.26,35.82 67.5,35.82 66.9,36.43 66.9,38.47 67,38.57 67,40.01 68.19,41.21 U6.8
$1N1649: length 7.7
  Top Layer w0.254: U6.4 77.54,35.62 R12.3 80.91,31.84 R13.2
$1N1651: length 8.5
  Top Layer w0.254: R9.3 41.62,35.82 45.28,35.82 45.96,36.5 R10.2 46.5,38.53 U2.4

## Copper pours and planes (outline as drawn; the poured copper is in the pictures)
GND on Top Layer: -14.69,-2.62 -14.69,68.59 110.66,68.59 110.66,-2.62
GND on Bottom Layer: -49.62,-15.83 100.12,-15.83 100.12,-100.79 -49.62,-100.79
VIN on Top Layer: 81.73,3.94 68.39,3.94 64.23,8.11 64.23,13.87 64.71,14.36 64.71,16.26 64.84,16.39 66.49,16.39 66.62,16.26 66.62,14.61 65.96,13.96 65.96,9.17 68.15,6.98 81.48,6.98 81.98,6.48 81.98,4.2

Small or netless copper shapes (teardrops, artwork), in the pictures only: 149 on Top Layer

## Text on the board
Top Silkscreen Layer: 辅助电源
